# EAGLE board M868 (EAGLE 4.11), part 1 of 2
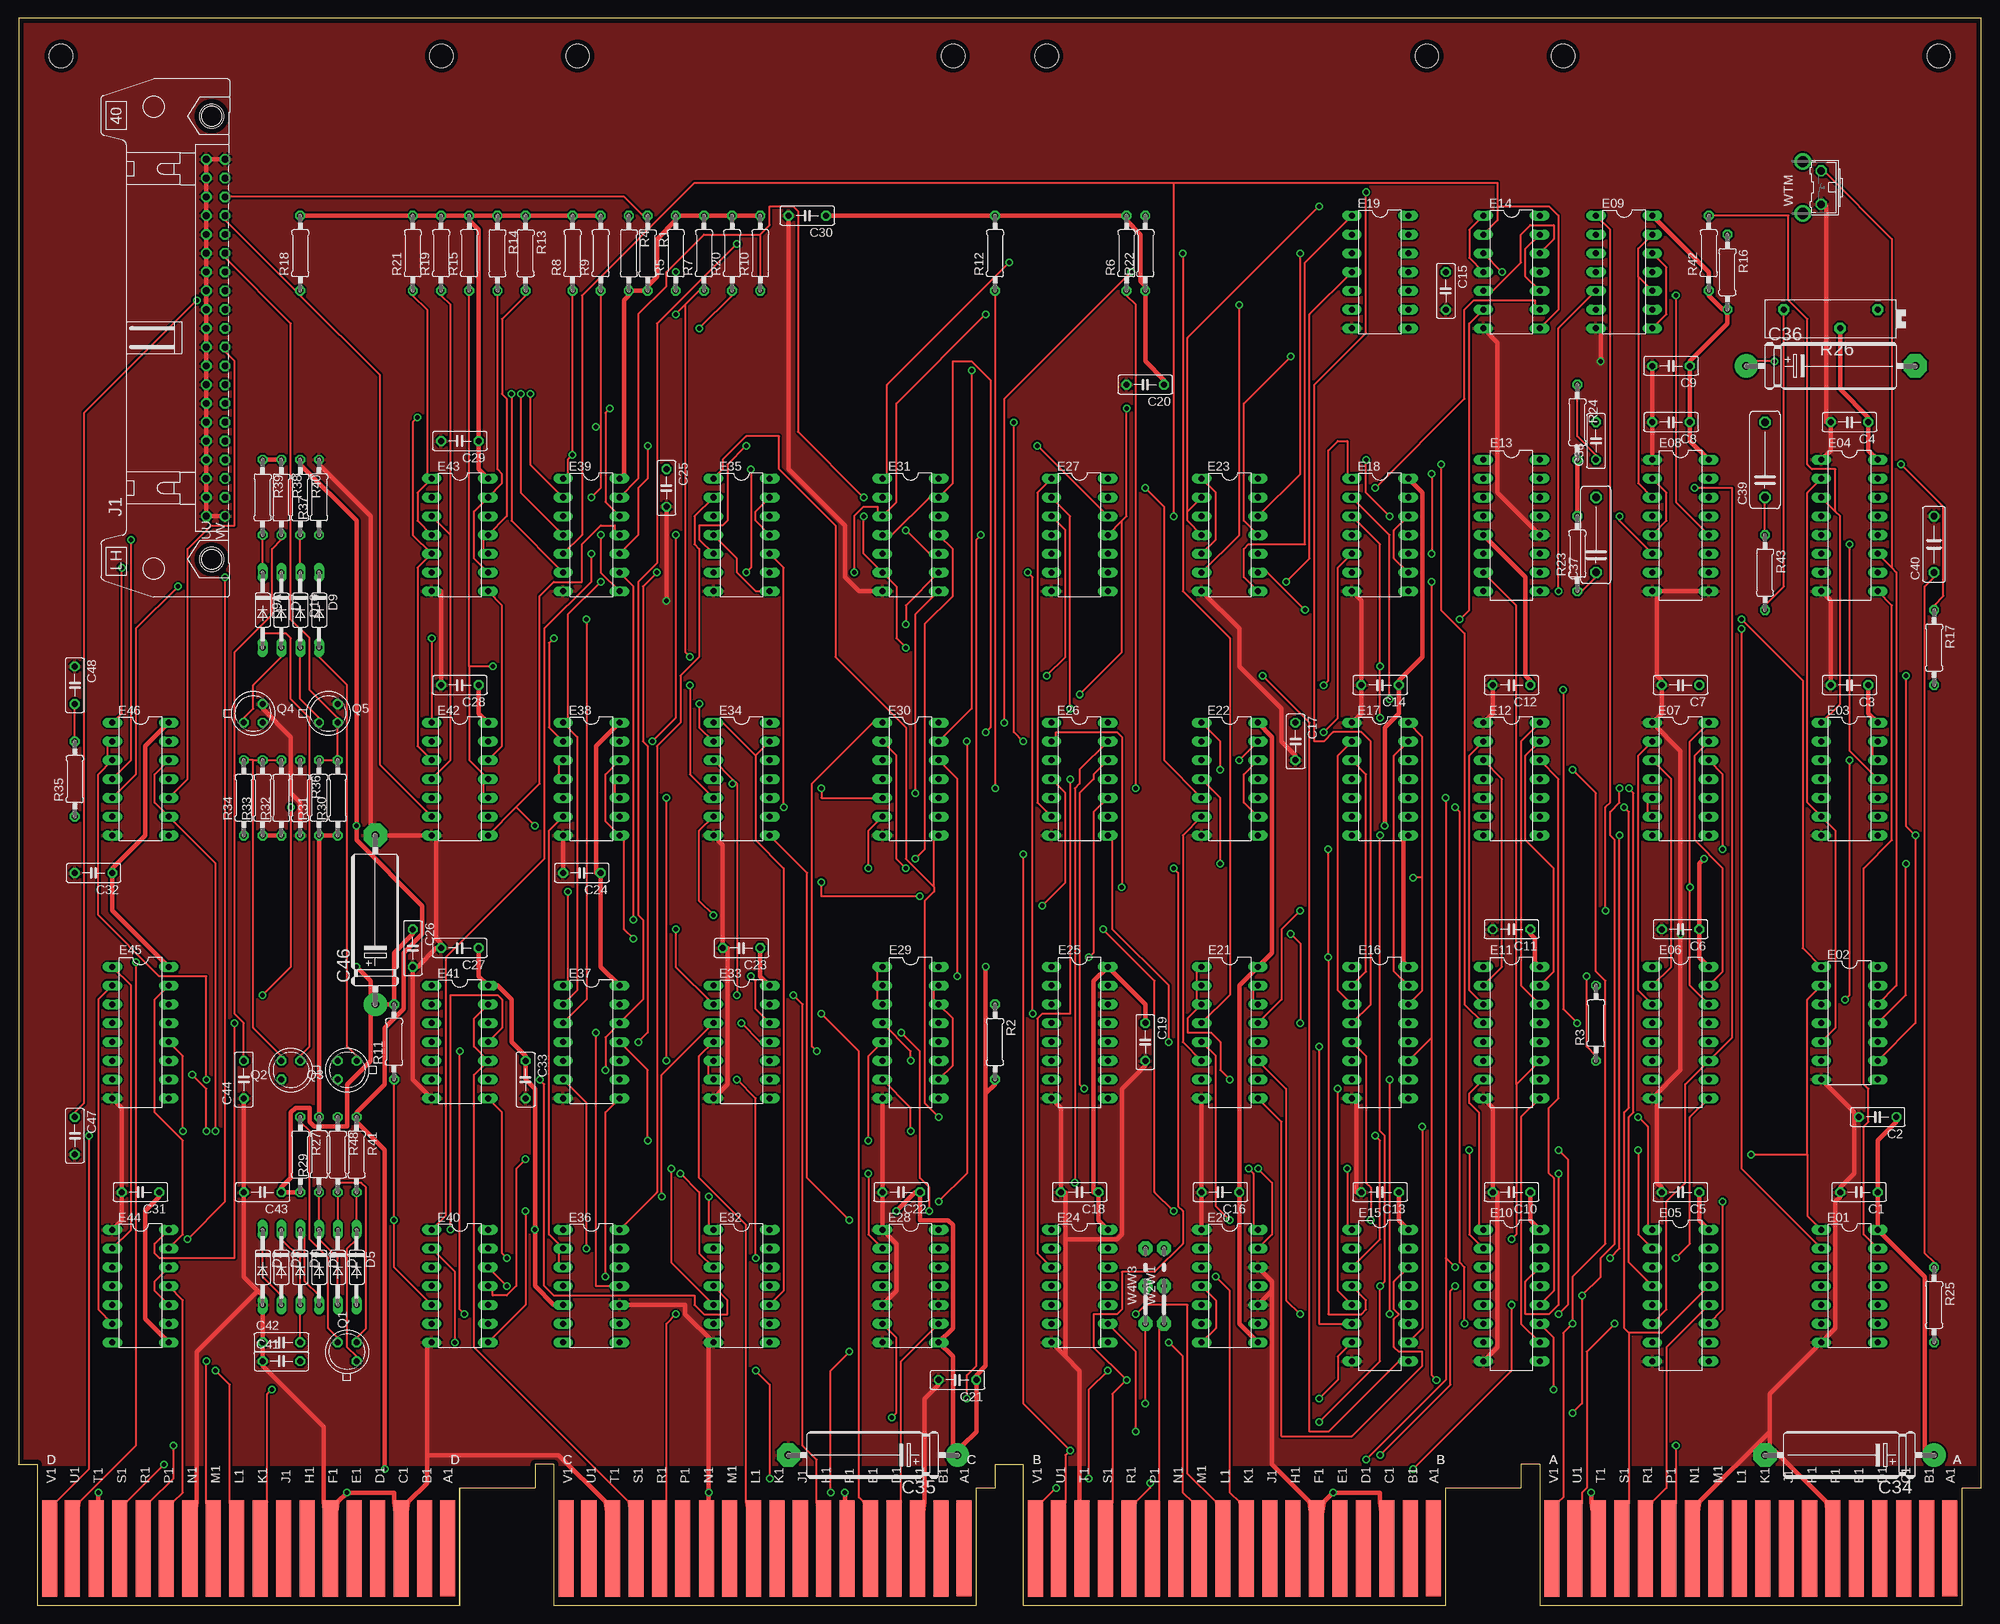
[diagram p3: board, top side]
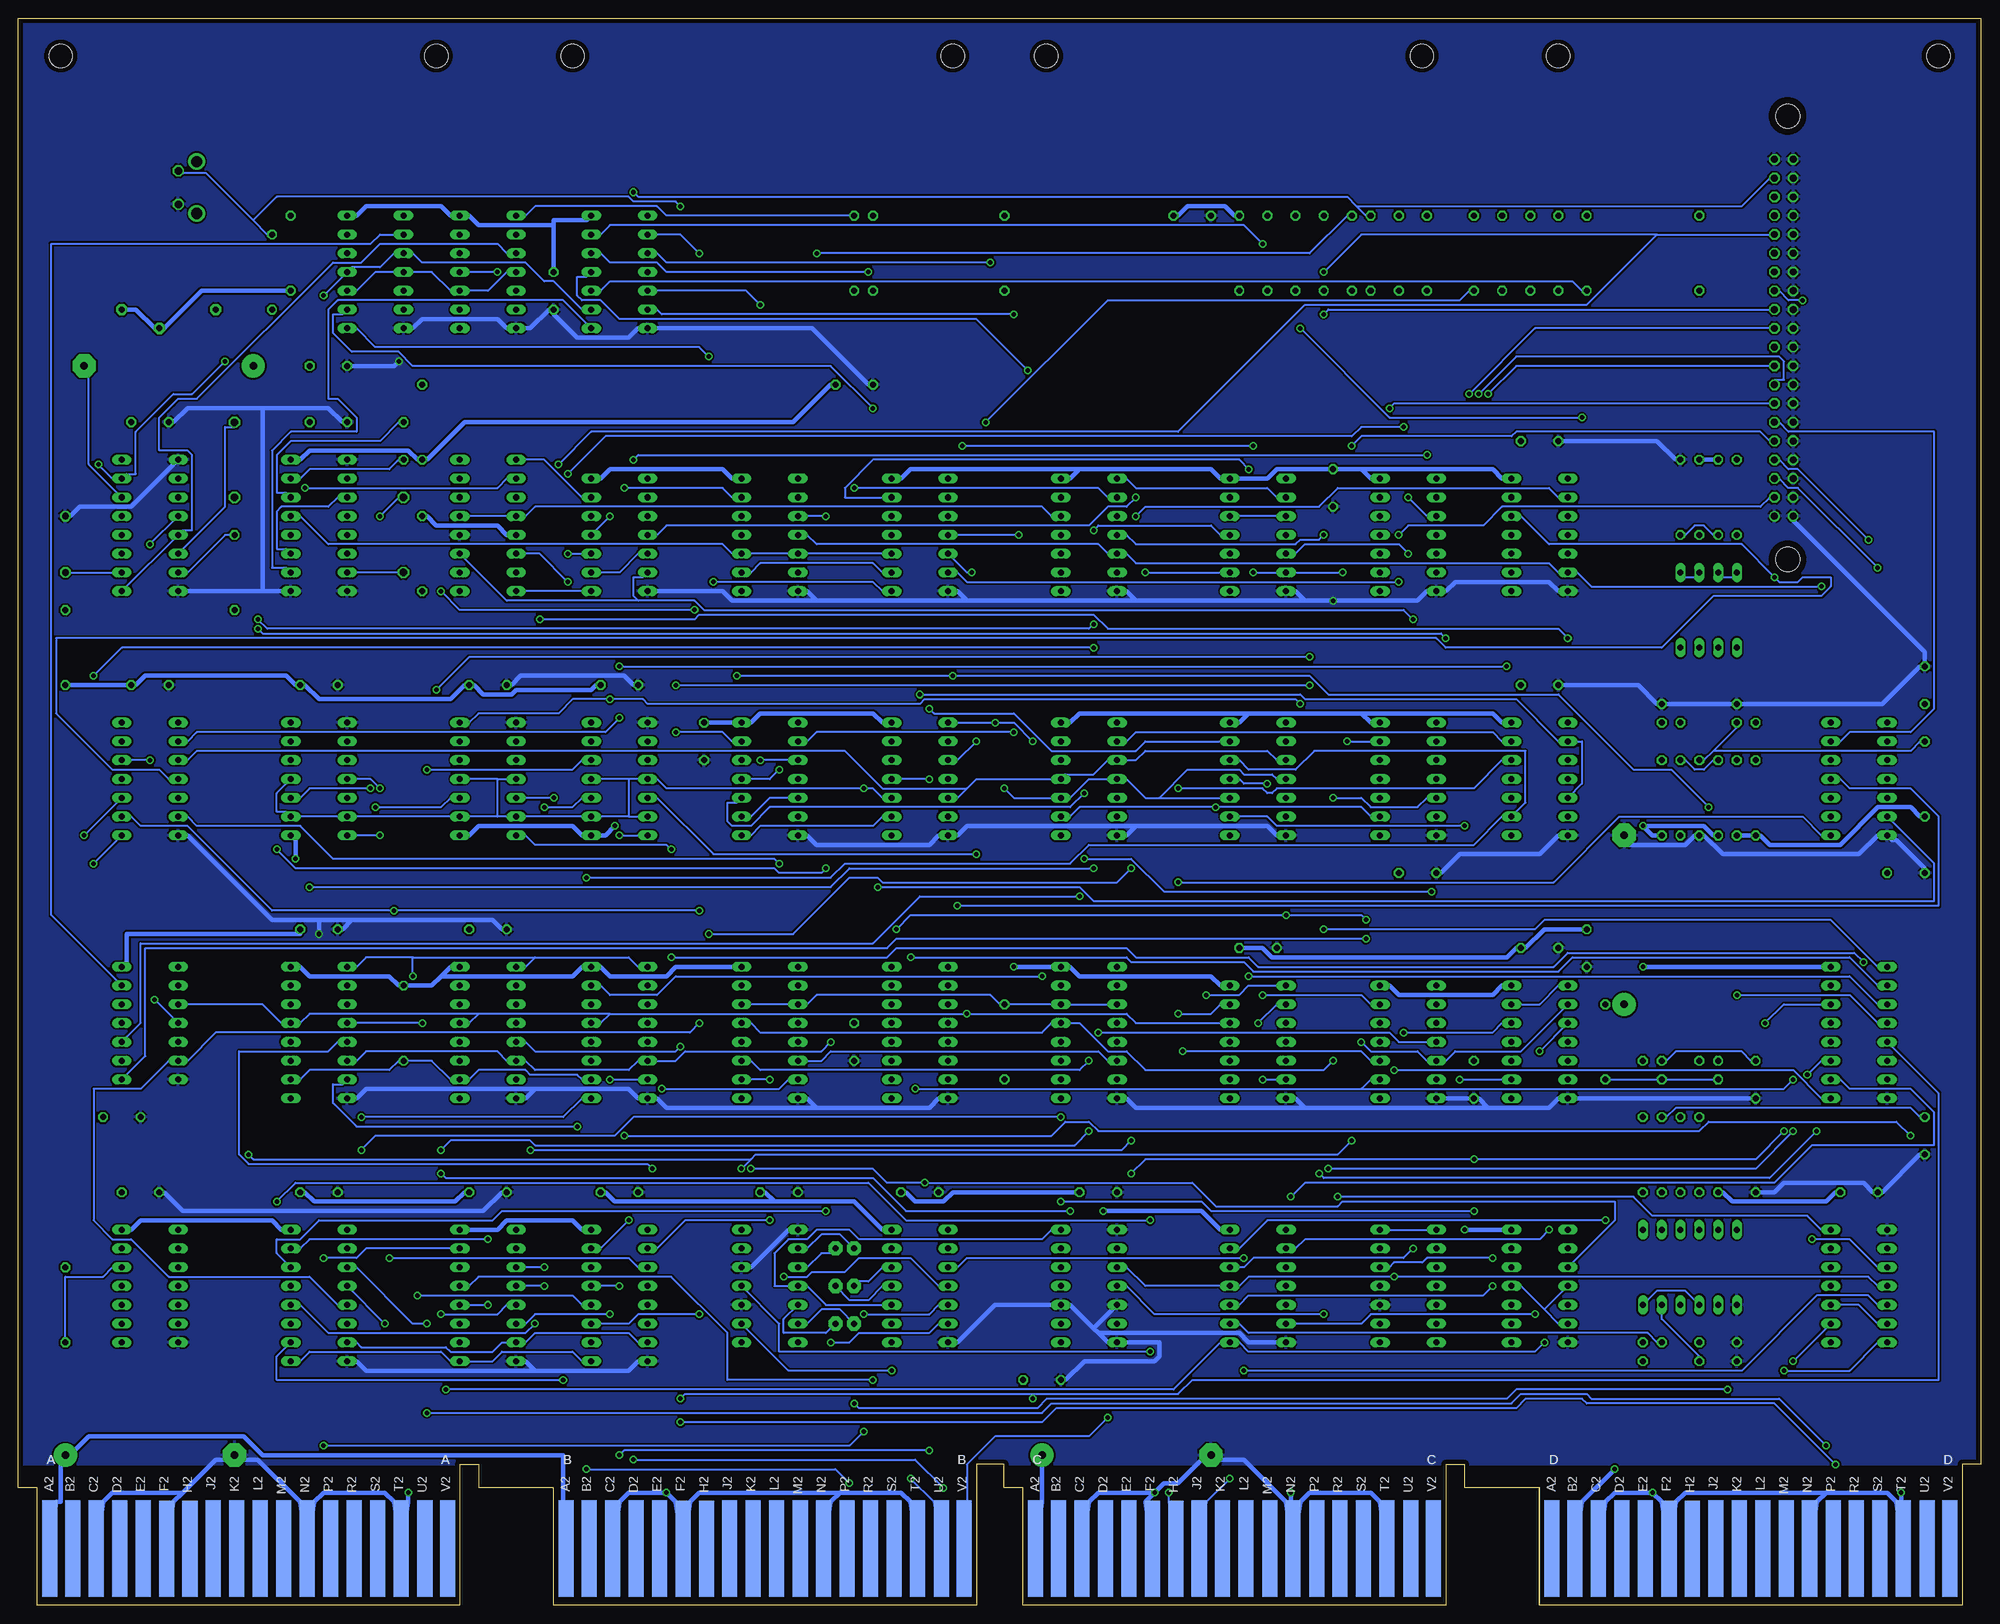
[diagram p4: board, bottom side, seen from below]

Size 265.43 x 214.63 mm. Coordinates in mm from the lower left corner, seen from the top.
Copper layers (1*16): Top 0.035mm / dielectric 1.5mm / Bottom 0.035mm
Design rules "10mils": minimum track width 10mil, minimum drill 24mil, track to track 10mil, track to pad 10mil, pad to pad 10mil, via to via 10mil, smd to smd 10mil, copper to edge 25mil, drill to drill 10mil, minimum pad ring 10mil, minimum via ring 8mil, stop-mask expansion 0mil, vias tented up to drill 0mil, thermal gap 10mil
Net classes: 1 supply: width 0.635 mm

## Footprints (pad centres in the part's own frame; a part is rotated, then mirrored left to right if it is on the bottom)
C050-025X075 = drill 0.813 octagon: 1 -2.54,0; 2 2.54,0
E22-6 = drill 1.016 pad 3.15 round: + -11.43,0 | drill 1.016 pad 3.15 octagon: - 11.43,0
C102-043X133 = drill 1.016 octagon: 1 -5.08,0; 2 5.08,0
C075-032X103 = drill 0.914 octagon: 1 -3.81,0; 2 3.81,0
DO35-10 = drill 0.813 long: A 5.08,0; C -5.08,0
DIL14 = drill 0.813 long: 1 -7.62,-3.81; 2 -5.08,-3.81; 3 -2.54,-3.81; 4 0,-3.81; 5 2.54,-3.81; 6 5.08,-3.81; 7 7.62,-3.81; 8 7.62,3.81; 9 5.08,3.81; 10 2.54,3.81; 11 0,3.81; 12 -2.54,3.81; 13 -5.08,3.81; 14 -7.62,3.81
DIL16 = drill 0.813 long: 1 -8.89,-3.81; 2 -6.35,-3.81; 3 -3.81,-3.81; 4 -1.27,-3.81; 5 1.27,-3.81; 6 3.81,-3.81; 7 6.35,-3.81; 8 8.89,-3.81; 9 8.89,3.81; 10 6.35,3.81; 11 3.81,3.81; 12 1.27,3.81; 13 -1.27,3.81; 14 -3.81,3.81; 15 -6.35,3.81; 16 -8.89,3.81
EDGE-CON8 = smd 2.032 x 13.017: AA1 261.223,7.709; AB1 258.118,7.684; AC1 254.956,7.684; AD1 251.765,7.684; AE1 248.59,7.693; AF1 245.389,7.668; AH1 242.24,7.668; AJ1 239.09,7.668; AK1 235.915,7.668; AL1 232.74,7.693; AM1 229.54,7.693; AN1 226.39,7.693; AP1 223.19,7.668; AR1 220.04,7.668; AS1 216.865,7.693; AT1 213.69,7.693; AU1 210.49,7.693; AV1 207.404,7.668; BA1 191.373,7.709; BB1 188.268,7.684; BC1 185.106,7.684; BD1 181.915,7.684; BE1 178.74,7.693; BF1 175.539,7.668; BH1 172.39,7.668; BJ1 169.24,7.668; BK1 166.065,7.668; BL1 162.89,7.693; BM1 159.69,7.693; BN1 156.54,7.693; BP1 153.34,7.668; BR1 150.19,7.668; BS1 147.015,7.693; BT1 143.84,7.693; BU1 140.64,7.693; BV1 137.554,7.668; CA1 127.873,7.709; CB1 124.768,7.684; CC1 121.606,7.684; CD1 118.415,7.684; CE1 115.24,7.693; CF1 112.039,7.668; CH1 108.89,7.668; CJ1 105.74,7.668; CK1 102.565,7.668; CL1 99.39,7.693; CM1 96.19,7.693; CN1 93.04,7.693; CP1 89.84,7.668; CR1 86.69,7.668; CS1 83.515,7.693; CT1 80.34,7.693; CU1 77.14,7.693; CV1 74.054,7.668; DA1 58.023,7.709; DB1 54.918,7.684; DC1 51.756,7.684; DD1 48.565,7.684; DE1 45.39,7.693; DF1 42.189,7.668; DH1 39.04,7.668; DJ1 35.89,7.668; DK1 32.715,7.668; DL1 29.54,7.693; DM1 26.34,7.693; DN1 23.19,7.693; DP1 19.99,7.668; DR1 16.84,7.668; DS1 13.665,7.693; DT1 10.49,7.693; DU1 7.29,7.693; DV1 4.204,7.668 | smd 2.032 x 13.017 bottom: AA2 261.223,7.69; AB2 258.102,7.668; AC2 254.94,7.668; AD2 251.765,7.693; AE2 248.59,7.693; AF2 245.389,7.642; AH2 242.24,7.642; AJ2 239.09,7.668; AK2 235.915,7.668; AL2 232.74,7.693; AM2 229.54,7.693; AN2 226.39,7.693; AP2 223.19,7.668; AR2 220.04,7.668; AS2 216.865,7.693; AT2 213.69,7.693; AU2 210.464,7.693; AV2 207.404,7.668; BA2 191.373,7.69; BB2 188.252,7.668; BC2 185.09,7.668; BD2 181.915,7.693; BE2 178.74,7.693; BF2 175.539,7.642; BH2 172.39,7.642; BJ2 169.24,7.668; BK2 166.065,7.668; BL2 162.89,7.693; BM2 159.69,7.693; BN2 156.54,7.693; BP2 153.34,7.668; BR2 150.19,7.668; BS2 147.015,7.693; BT2 143.84,7.693; BU2 140.614,7.693; BV2 137.554,7.668; CA2 127.873,7.69; CB2 124.752,7.668; CC2 121.59,7.668; CD2 118.415,7.693; CE2 115.24,7.693; CF2 112.039,7.642; CH2 108.89,7.642; CJ2 105.74,7.668; CK2 102.565,7.668; CL2 99.39,7.693; CM2 96.19,7.693; CN2 93.04,7.693; CP2 89.84,7.668; CR2 86.69,7.668; CS2 83.515,7.693; CT2 80.34,7.693; CU2 77.114,7.693; CV2 74.054,7.668; DA2 58.023,7.69; DB2 54.902,7.668; DC2 51.74,7.668; DD2 48.565,7.693; DE2 45.39,7.693; DF2 42.189,7.642; DH2 39.04,7.642; DJ2 35.89,7.668; DK2 32.715,7.668; DL2 29.54,7.693; DM2 26.34,7.693; DN2 23.19,7.693; DP2 19.99,7.668; DR2 16.84,7.668; DS2 13.665,7.693; DT2 10.49,7.693; DU2 7.264,7.693; DV2 4.204,7.668
DEC40PINH = drill 0.914 octagon: A 24.13,1.27; AA -3.81,1.27; B 24.13,-1.27; BB -3.81,-1.27; C 21.59,1.27; CC -6.35,1.27; D 21.59,-1.27; DD -6.35,-1.27; E 19.05,1.27; EE -8.89,1.27; F 19.05,-1.27; FF -8.89,-1.27; H 16.51,1.27; HH -11.43,1.27; J 16.51,-1.27; JJ -11.43,-1.27; K 13.97,1.27; KK -13.97,1.27; L 13.97,-1.27; LL -13.97,-1.27; M 11.43,1.27; MM -16.51,1.27; N 11.43,-1.27; NN -16.51,-1.27; P 8.89,1.27; PP -19.05,1.27; R 8.89,-1.27; RR -19.05,-1.27; S 6.35,1.27; SS -21.59,1.27; T 6.35,-1.27; TT -21.59,-1.27; U 3.81,1.27; UU -24.13,1.27; V 3.81,-1.27; W 1.27,1.27; X 1.27,-1.27; Y -1.27,1.27; Z -1.27,-1.27 | drill 0.914 round: VV -24.13,-1.27 | hole 3.302: -29.972,0.533; 29.972,0.533
TO18 = drill 0.813 octagon: 1 -1.27,-1.27; 2 1.27,-1.27; 3 1.27,1.27
0207/10 = drill 0.813 octagon: 1 -5.08,0; 2 5.08,0
PT-SPIN = drill 0.813 pad 1.524 octagon: 1 -6.35,-1.27; 2 6.35,-1.27; 3 -1.27,1.27
OMNIBUS = hole 3.175: 208.915,209.55; 259.715,209.55; 190.5,209.55; 139.065,209.55; 75.616,209.55; 126.416,209.55; 57.201,209.55; 5.766,209.55
05C = drill 0.813 pad 1.905 octagon: 1 -2.54,0; 2 2.54,0; 3 7.62,0
B3F-31XX = drill 1.016 octagon: 1 -2.261,-1.245; 2 2.261,-1.245 | drill 1.499 pad 2.159 round: 3 -3.505,1.245; 4 3.505,1.245

## Placement (x,y rotation side)
C1  .01  [C050-025X075]  248.92,55.88 180 top
C2  .01  [C050-025X075]  251.46,66.04 180 top
C3  .01  [C050-025X075]  247.65,124.46 180 top
C4  .01  [C050-025X075]  247.65,160.02 180 top
C5  .01  [C050-025X075]  224.79,55.88 180 top
C6  .01  [C050-025X075]  224.79,91.44 180 top
C7  .01  [C050-025X075]  224.79,124.46 180 top
C8  .01  [C050-025X075]  223.52,160.02 180 top
C9  .01  [C050-025X075]  223.52,167.64 180 top
C10  .01  [C050-025X075]  201.93,55.88 180 top
C11  .01  [C050-025X075]  201.93,91.44 180 top
C12  .01  [C050-025X075]  201.93,124.46 180 top
C13  .01  [C050-025X075]  184.15,55.88 180 top
C14  .01  [C050-025X075]  184.15,124.46 180 top
C15  .01  [C050-025X075]  193.04,177.8 270 top
C16  .01  [C050-025X075]  162.56,55.88 180 top
C17  .01  [C050-025X075]  172.72,116.84 270 top
C18  .01  [C050-025X075]  143.51,55.88 180 top
C19  .01  [C050-025X075]  152.4,76.2 270 top
C20  .01  [C050-025X075]  152.4,165.1 180 top
C21  .01  [C050-025X075]  127,30.48 180 top
C22  .01  [C050-025X075]  119.38,55.88 180 top
C23  .01  [C050-025X075]  97.79,88.9 180 top
C24  .01  [C050-025X075]  76.2,99.06 180 top
C25  .01  [C050-025X075]  87.63,151.13 270 top
C26  .01  [C050-025X075]  53.34,88.9 270 top
C27  .01  [C050-025X075]  59.69,88.9 180 top
C28  .01  [C050-025X075]  59.69,124.46 180 top
C29  .01  [C050-025X075]  59.69,157.48 180 top
C30  .01  [C050-025X075]  106.68,187.96 180 top
C31  .01  [C050-025X075]  16.51,55.88 180 top
C32  .01  [C050-025X075]  10.16,99.06 180 top
C33  .01  [C050-025X075]  68.58,71.12 270 top
C34  6.8  [E22-6]  247.65,20.32 180 top
C35  6.8  [E22-6]  115.57,20.32 180 top
C36  6.8  [E22-6]  245.11,167.64 0 top
C37  2700pf  [C102-043X133]  213.36,144.78 90 top
C38  27pf  [C050-025X075]  213.36,157.48 90 top
C39  2700pf  [C102-043X133]  236.22,154.94 90 top
C40  560pf  [C075-032X103]  259.08,143.51 90 top
C41  .01  [C050-025X075]  35.56,33.02 0 top
C42  .01  [C050-025X075]  35.56,35.56 0 top
C43  .01  [C050-025X075]  33.02,55.88 180 top
C44  .01  [C050-025X075]  30.48,71.12 90 top
C46  6.8  [E22-6]  48.26,92.71 90 top
C47  .01  [C050-025X075]  7.62,63.5 270 top
C48  .01  [C050-025X075]  7.62,124.46 270 top
D1  D664  [DO35-10]  43.18,45.72 270 top
D2  D662  [DO35-10]  33.02,45.72 270 top
D3  D662  [DO35-10]  35.56,45.72 270 top
D4  D662  [DO35-10]  38.1,45.72 270 top
D5  D664  [DO35-10]  45.72,45.72 270 top
D6  D662  [DO35-10]  40.64,45.72 270 top
D7  D664  [DO35-10]  35.56,134.62 270 top
D9  D664  [DO35-10]  40.64,134.62 270 top
D9A  D664  [DO35-10]  33.02,134.62 270 top
D10  D664  [DO35-10]  38.1,134.62 270 top
E01  74H04N  [DIL14]  247.65,43.18 270 top
E02  7402N  [DIL14]  247.65,78.74 270 top
E03  7474N  [DIL14]  247.65,111.76 270 top
E04  74123N  [DIL16]  247.65,146.05 270 top
E05  DEC8235  [DIL16]  224.79,41.91 270 top
E06  DEC8271  [DIL16]  224.79,77.47 270 top
E07  SP380N  [DIL14]  224.79,111.76 270 top
E08  74123N  [DIL16]  224.79,146.05 270 top
E09  7474N  [DIL14]  217.17,180.34 270 top
E10  DEC8235  [DIL16]  201.93,41.91 270 top
E11  DEC8271  [DIL16]  201.93,77.47 270 top
E12  SP380N  [DIL14]  201.93,111.76 270 top
E13  7475N  [DIL16]  201.93,146.05 270 top
E14  7474N  [DIL14]  201.93,180.34 270 top
E15  DEC8235  [DIL16]  184.15,41.91 270 top
E16  DEC8271  [DIL16]  184.15,77.47 270 top
E17  SP380N  [DIL14]  184.15,111.76 270 top
E18  DEC8242  [DIL14]  184.15,144.78 270 top
E19  7400N  [DIL14]  184.15,180.34 270 top
E20  SP380N  [DIL14]  163.83,43.18 270 top
E21  DEC8271  [DIL16]  163.83,77.47 270 top
E22  7400N  [DIL14]  163.83,111.76 270 top
E23  7410N  [DIL14]  163.83,144.78 270 top
E24  SP314N  [DIL14]  143.51,43.18 270 top
E25  [DIL16]  143.51,77.47 270 top
E26  7404N  [DIL14]  143.51,111.76 270 top
E27  7410N  [DIL14]  143.51,144.78 270 top
E28  SP384N  [DIL14]  120.65,43.18 270 top
E29  DEC8271  [DIL16]  120.65,77.47 270 top
E30  7474N  [DIL14]  120.65,111.76 270 top
E31  7404N  [DIL14]  120.65,144.78 270 top
E32  7404N  [DIL14]  97.79,43.18 270 top
E33  N8881N  [DIL14]  97.79,76.2 270 top
E34  7474N  [DIL14]  97.79,111.76 270 top
E35  7410N  [DIL14]  97.79,144.78 270 top
E36  74LS93N  [DIL14]  77.47,43.18 270 top
E37  7402N  [DIL14]  77.47,76.2 270 top
E38  7400N  [DIL14]  77.47,111.76 270 top
E39  7417N  [DIL14]  77.47,144.78 270 top
E40  7430N  [DIL14]  59.69,43.18 270 top
E41  N8881N  [DIL14]  59.69,76.2 270 top
E42  DEC8242  [DIL14]  59.69,111.76 270 top
E43  7401N  [DIL14]  59.69,144.78 270 top
E44  SP380N  [DIL14]  16.51,43.18 270 top
E45  DEC8251  [DIL16]  16.51,77.47 270 top
E46  7401N  [DIL14]  16.51,111.76 270 top
EDGE$  [EDGE-CON8]  0,0 0 top
J1  [DEC40PINH]  26.67,171.45 90 top
Q1  MPS6534  [TO18]  44.45,34.29 90 top
Q2  MPS6534  [TO18]  36.83,72.39 180 top
Q3  MPS6534  [TO18]  44.45,72.39 180 top
Q4  MPS6534  [TO18]  31.75,120.65 0 top
Q5  MPS6534  [TO18]  41.91,120.65 0 top
R1  270  [0207/10]  85.09,182.88 270 top
R2  1K  [0207/10]  132.08,76.2 270 top
R3  1K  [0207/10]  213.36,78.74 90 top
R4  270  [0207/10]  82.55,182.88 270 top
R5  270  [0207/10]  88.9,182.88 90 top
R6  560  [0207/10]  149.86,182.88 90 top
R7  270  [0207/10]  92.71,182.88 90 top
R8  470  [0207/10]  74.93,182.88 90 top
R9  470  [0207/10]  78.74,182.88 90 top
R10  470  [0207/10]  100.33,182.88 90 top
R11  6.8K  [0207/10]  50.8,76.2 90 top
R12  1K  [0207/10]  132.08,182.88 90 top
R13  470  [0207/10]  68.58,182.88 270 top
R14  470  [0207/10]  64.77,182.88 270 top
R15  470  [0207/10]  60.96,182.88 90 top
R16  1.5K  [0207/10]  231.14,180.34 270 top
R17  51K  [0207/10]  259.08,129.54 270 top
R18  270  [0207/10]  38.1,182.88 90 top
R19  470  [0207/10]  57.15,182.88 90 top
R20  470  [0207/10]  96.52,182.88 90 top
R21  470  [0207/10]  53.34,182.88 90 top
R22  1K  [0207/10]  152.4,182.88 90 top
R23  10K  [0207/10]  210.82,142.24 90 top
R24  4.7K  [0207/10]  210.82,160.02 270 top
R25  220  [0207/10]  259.08,40.64 270 top
R26  10K  [PT-SPIN]  245.11,173.99 180 top
R27  1.5K  [0207/10]  38.1,60.96 270 top
R29  1.5K  [0207/10]  40.64,60.96 90 top
R30  1K  [0207/10]  43.18,109.22 90 top
R31  1K  [0207/10]  40.64,109.22 90 top
R32  1K  [0207/10]  35.56,109.22 90 top
R33  1K  [0207/10]  33.02,109.22 90 top
R34  1K  [0207/10]  30.48,109.22 90 top
R35  1.21K 1%  [0207/10]  7.62,111.76 90 top
R36  562 1%  [0207/10]  38.1,109.22 270 top
R37  1.5K  [0207/10]  40.64,149.86 90 top
R38  1K  [0207/10]  35.56,149.86 270 top
R39  1.5K  [0207/10]  33.02,149.86 270 top
R40  1K  [0207/10]  38.1,149.86 270 top
R41  3K  [0207/10]  45.72,60.96 270 top
R42  1K  [0207/10]  228.6,182.88 90 top
R43  4.7K  [0207/10]  236.22,139.7 270 top
R48  470  [0207/10]  43.18,60.96 270 top
U$1  OUTLINE-OMNIBUS  [OMNIBUS]  0,0 0 top
W2W1  [05C]  154.94,40.64 90 top
W4W3  [05C]  152.4,40.64 90 top
WTM  [B3F-31XX]  242.57,191.77 90 top

## Tracks (layer width: path | path; a pad name or v marks a point on that pad's centre or on a via)
-1.5V
  Top 0.254: C42.2 D4.A 38.1,46.99 35.56,49.53 D3.C
  Bottom 0.254: D5.A 43.81,42.55 40.01,42.55 D4.A
-3V
  Top 0.254: R29.1 D6.C 40.64,49.53 43.18,46.99 D1.A
  Bottom 0.254: C41.2 38.1,33.66 43.18,38.74 D1.A
-4.7V
  Top 0.254: R35.2 C48.2
  Bottom 0.254: 36.2,115.57 33.02,118.75 Q4.2 | 36.2,115.57 37.47,114.3 R36.1 | 36.2,115.57 9.53,115.57 8.26,116.84 R35.2
-9V
  Top 0.254: R38.2 35.56,144.15 34.29,142.88 34.29,133.99 29.21,128.91 29.21,80.01 30.48,78.74 C44.2
  Bottom 0.254: R38.2 36.2,144.78 37.47,146.05 38.73,146.05 40.01,144.78 R37.1 | C44.2 31.11,73.66 32.38,74.93 41.27,74.93 42.55,73.66 Q3.2
-15V  (via drill 0.61)
  Top 0.635: v49.53,18.42 49.53,61.6 45.72,65.41 R41.1 45.72,66.68 49.53,70.49 49.53,78.11 52.07,80.65 52.07,88.27 54.61,90.81 54.61,94.62 45.72,103.51 v45.72,105.41 45.72,146.69 38.1,154.31 R40.1 | R32.1 R33.1 | R38.1 R39.1 | R29.2 R31.1 R30.1
  Bottom 0.635: v49.53,18.42 53.98,13.97 EDGE$.DB2 | R33.1 R34.1 29.84,104.14 28.57,102.87 19.05,102.87 13.97,107.95 9.53,107.95 8.26,106.68 R35.1 | R40.1 R38.1 | R30.1 44.45,104.14 v45.72,105.41 37.47,105.41 36.2,104.14 R32.1
C0  (via drill 0.61)
  Top 0.254: v108.58,80.01 113.67,74.93 113.67,14.61 114.3,13.97 EDGE$.CE1
  Bottom 0.254: v108.58,80.01 104.14,80.01 102.87,81.28 E33.13
C1  (via drill 0.61)
  Top 0.254: v104.78,82.55 106.05,81.28 106.05,21.59 107.95,19.69 107.95,13.97 EDGE$.CH1
  Bottom 0.254: v104.78,82.55 100.33,82.55 99.06,83.82 E33.1
CC_67X  (via drill 0.61)
  Top 0.254: E33.6 93.34,71.76 93.34,73.03 E33.5 | v142.24,111.76 142.24,80.01 138.43,80.01 137.79,79.38 137.79,47.63 E24.3 | v97.16,71.12 99.69,68.58 v99.69,46.99
  Bottom 0.254: v142.24,111.76 E26.11 | v99.69,46.99 137.16,46.99 138.43,45.72 E24.3 | v97.16,71.12 E33.6
CC_67X\  (via drill 0.61)
  Top 0.254: E45.2 10.79,81.92 10.79,40.01 E44.6 | E44.12 18.41,43.82 18.41,42.55 E44.10 | E07.6 220.34,107.32 220.34,108.59 E07.5 | v151.13,110.49 151.13,175.9 149.86,177.17 R6.1 | v144.78,87.63 145.41,88.27 145.41,107.32 E26.10
  Bottom 0.254: E44.6 13.97,38.1 16.51,40.64 E44.10 | E07.11 230.5,109.86 230.5,107.32 229.24,107.32 E07.9 E07.6 E12.9 200.66,106.68 | 200.66,106.68 E12.6 E17.9 182.88,106.68 | 200.66,111.76 E12.4 | 200.66,111.76 E12.11 | 200.66,106.68 200.66,111.76 | 182.88,106.68 E17.6 | E26.10 148.59,109.22 149.86,110.49 v151.13,110.49 177.8,110.49 179.07,111.76 E17.4 182.88,111.76 | 182.88,111.76 E17.11 | 182.88,111.76 182.88,106.68 | v144.78,87.63 115.57,87.63 114.94,87 99.69,87 98.42,85.73 57.15,85.73 55.24,87.63 17.78,87.63 13.97,83.82 E45.2
CC_BTP3  (via drill 0.61)
  Top 0.254: v233.04,132.08 233.04,59.06 E01.2 | v72.39,130.81 71.75,130.18 71.75,118.75 E38.2
  Bottom 0.254: v233.04,132.08 232.41,131.45 73.03,131.45 v72.39,130.81
CC_CLK_TE\
  Top 0.254: E26.6 137.79,108.59 137.79,150.5 E27.1
CC_DTP
  Top 0.254: E23.1 161.93,150.5 161.93,144.15 E23.5
  Bottom 0.254: E27.10 E23.5 E23.10 168.91,142.24 170.18,143.51 223.52,143.51 227.33,147.32 E08.13
CC_DTP0  (via drill 0.61)
  Top 0.254: v113.03,139.7 113.03,147.32 114.3,148.59 116.2,148.59 116.2,147.96 E31.3 118.75,149.23 118.75,162.56 v130.81,174.63
  Bottom 0.254: v113.03,139.7 E35.9 | v130.81,174.63 178.44,174.63 179.07,175.26 E19.6
CC_DTP0\  (via drill 0.61)
  Top 0.254: v85.72,116.84 88.9,120.02 v88.9,144.78 | E31.4 118.11,144.78 123.19,149.86 E31.13 126.36,151.77 126.36,168.28 128.91,168.28 131.44,165.74 131.44,118.75 v130.81,118.11
  Bottom 0.254: v88.9,144.78 89.53,144.15 92.08,144.15 92.71,143.51 114.3,143.51 115.57,144.78 E31.4 | v85.72,116.84 E38.13 | v130.81,118.11 157.48,118.11 158.75,116.84 E22.2
CC_DTP1  (via drill 0.61)
  Top 0.254: v133.99,181.61 117.47,165.1 117.47,153.04 E31.1 | E36.14 86.36,55.88 86.36,116.21 89.53,119.38 89.53,125.73 92.08,128.27 92.08,142.88 91.44,143.51 91.44,147.32 E35.2
  Bottom 0.254: E36.14 E36.1 | E35.2 95.25,149.86 96.52,151.13 114.3,151.13 115.57,152.4 E31.1 | v133.99,181.61 177.8,181.61 179.07,182.88 E19.3
CC_DTP1\  (via drill 0.61)
  Top 0.254: v152.4,151.13 154.94,148.59 154.94,114.3 E22.5 | E22.12 165.74,112.4 165.74,108.59 E22.9
  Bottom 0.254: v152.4,151.13 119.38,151.13 118.11,149.86 E31.2 | E22.9 166.37,106.68 163.83,109.22 E22.5
CC_F/R  (via drill 0.61)
  Top 0.254: v90.81,124.46 90.81,112.4 E34.5 | v176.53,124.46 177.16,125.1 177.16,156.21 178.44,157.48 179.71,157.48 179.71,153.04 E18.1
  Bottom 0.254: v176.53,124.46 v90.81,124.46
CC_F/R\  (via drill 0.61)
  Top 0.254: v156.21,53.34 153.67,55.88 153.67,84.46 v146.69,91.44 | v93.98,93.35 92.08,95.25 92.08,104.78 E34.6 | v83.19,92.71 83.19,137.8 E39.9
  Bottom 0.254: v156.21,53.34 200.03,53.34 201.29,52.07 224.79,52.07 227.33,49.53 230.5,49.53 230.5,47.63 E05.14 | v146.69,91.44 144.78,93.35 v93.98,93.35 83.82,93.35 v83.19,92.71
CC_INIT  (via drill 0.61)
  Top 0.254: v79.38,44.45 79.38,66.68 E37.8
  Bottom 0.254: E44.4 13.97,43.18 15.24,44.45 v79.38,44.45 99.06,44.45 100.33,43.18 E32.11 113.03,43.18 115.57,45.72 E28.3
CC_INIT\  (via drill 0.61)
  Top 0.254: 99.69,114.94 99.69,103.51 103.5,99.7 103.5,42.55 E32.10 | E34.13 99.69,114.94 | v66.04,43.18 E40.12 | 99.69,114.94 95.25,119.38 E34.1 | v142.24,121.29 142.24,147.32 E27.2
  Bottom 0.254: v66.04,43.18 67.31,41.91 99.06,41.91 100.33,40.64 E32.10 | v142.24,121.29 141.6,120.65 130.81,120.65 125.73,115.57 114.3,115.57 113.03,116.84 E34.13
CC_PWR_OK  (via drill 0.61)
  Top 0.254: E46.12 18.41,112.4 18.41,108.59 E46.9 26.67,100.33 v26.67,64.14 | v114.94,58.42 114.94,50.17 E28.2 | v68.58,60.33 67.31,59.06 67.31,43.18 66.04,41.91 64.14,41.91 64.14,42.55 E40.11
  Bottom 0.254: 59.05,40.01 62.23,43.18 E40.11 | 59.05,40.01 57.15,38.1 E40.6 | 59.05,40.01 E40.4 | v114.94,58.42 113.03,60.33 v68.58,60.33 30.48,60.33 v26.67,64.14
CC_R/W  (via drill 0.61)
  Top 0.254: v103.5,107.95 103.5,140.34 E35.10
  Bottom 0.254: E38.9 82.55,106.68 83.82,107.95 v103.5,107.95 121.92,107.95 123.19,106.68 E30.9
CC_R/W\  (via drill 0.61)
  Top 0.254: v219.07,61.6 219.07,50.17 E05.2 | v124.46,66.04 122.56,67.95 122.56,95.25 123.83,96.52 123.83,97.16 | 123.83,97.16 123.83,103.51 E30.8 | 123.83,97.16 120.02,100.97 120.02,118.75 110.49,128.27 110.49,146.05 102.87,153.67 102.87,158.12 98.42,158.12 95.25,154.94 95.25,153.67 E35.1
  Bottom 0.254: v219.07,61.6 217.17,63.5 184.78,63.5 182.25,66.04 v124.46,66.04
CC_RUN  (via drill 0.61)
  Top 0.254: E46.2 12.06,116.21 12.06,114.94 E46.3 10.79,112.4 10.79,93.35 19.05,85.09 25.4,85.09 v25.4,71.12 | v144.15,69.85 143.51,70.49 143.51,109.86 145.41,111.76 145.41,112.4 E26.12
  Bottom 0.254: 83.82,69.85 82.55,71.12 E37.9 | v144.15,69.85 83.82,69.85 | v25.4,71.12 26.67,69.85 83.82,69.85
CC_RUN\  (via drill 0.61)
  Top 0.254: v166.37,59.06 167,58.42 167,51.44 E20.14 | v142.88,57.15 142.88,110.49 143.51,111.13 143.51,113.03 E26.13
  Bottom 0.254: v166.37,59.06 149.86,59.06 147.96,57.15 v142.88,57.15 106.68,57.15 103.5,53.98 87,53.98 86.36,54.61 49.53,54.61 49.53,52.07 E40.3
CC_S/G  (via drill 0.61)
  Top 0.254: E42.12 65.41,116.21 65.41,135.26 E43.8 | v108.58,110.49 108.58,109.22 E30.5
  Bottom 0.254: v108.58,110.49 97.16,110.49 96.52,109.86 95.89,109.86 95.25,110.49 68.58,110.49 64.77,114.3 E42.12
CC_S/G\  (via drill 0.61)
  Top 0.254: v114.94,99.7 114.94,104.78 E30.6 | v172.09,90.81 173.35,89.54 v173.35,78.74
  Bottom 0.254: E05.5 222.25,40.64 226.06,44.45 245.11,44.45 250.19,49.53 252.73,49.53 255.27,52.07 255.27,69.85 248.92,69.85 245.11,73.66 E02.6 242.57,73.66 238.76,77.47 174.62,77.47 v173.35,78.74 | v114.94,99.7 116.84,97.79 148.59,97.79 149.22,98.43 153.03,98.43 160.66,90.81 v172.09,90.81
CC_SDLC\  (via drill 0.61)
  Top 0.254: v79.38,72.39 79.38,76.84 E37.12 84.45,81.92 84.45,92.71 83.82,93.35 83.82,138.43 86.36,140.97 86.36,173.36 v97.16,184.15
  Bottom 0.254: v79.38,72.39 25.4,72.39 21.59,68.58 E45.9 | v97.16,184.15 99.69,186.69 185.42,186.69 186.69,185.42 E19.13
CC_SDLD\  (via drill 0.61)
  Top 0.254: v99.06,85.09 99.69,84.46 99.69,80.65 E33.12 | v136.53,139.7 137.16,139.07 v137.16,80.01
  Bottom 0.254: E02.3 232.41,81.28 229.87,78.74 E06.13 227.33,78.74 226.06,80.01 203.2,80.01 | 185.42,80.01 v137.16,80.01 115.57,80.01 114.3,78.74 E33.12 | 185.42,80.01 186.69,78.74 E16.13 | 203.2,80.01 204.47,78.74 E11.13 | 185.42,80.01 203.2,80.01 | v99.06,85.09 17.78,85.09 13.97,81.28 E45.3 | v136.53,139.7 137.16,139.7 E27.5
CC_SDRC\  (via drill 0.61)
  Top 0.254: v33.02,82.55 36.83,86.36 v36.83,107.95 | v139.06,125.73 141.6,128.27 141.6,145.42 E27.3 | v168.28,125.73 174.62,119.38 174.62,23.5 177.16,23.5 186.69,33.02 E15.9
  Bottom 0.254: E15.9 189.23,33.02 190.5,34.29 200.03,34.29 201.29,33.02 E10.9 207.01,33.02 208.28,34.29 226.06,34.29 227.33,33.02 E05.9 | v33.02,82.55 17.78,82.55 13.97,78.74 E45.4 | v36.83,107.95 41.91,113.03 46.99,113.03 57.15,123.19 88.27,123.19 90.81,125.73 v139.06,125.73 v168.28,125.73
CC_SDRD\  (via drill 0.61)
  Top 0.254: v175.9,27.94 178.44,30.48 178.44,33.66 E15.7 | v130.18,144.78 129.54,144.15 129.54,32.39 128.27,31.12 v128.27,27.94
  Bottom 0.254: E15.7 181.61,35.56 182.88,36.83 195.58,36.83 196.85,35.56 E10.7 200.03,35.56 201.29,34.29 207.01,34.29 207.65,34.93 219.07,34.93 219.71,35.56 E05.7 | 128.27,28.58 175.26,28.58 v175.9,27.94 | 128.27,28.58 108.58,28.58 106.68,30.48 5.71,30.48 5.71,69.22 E45.5 | 128.27,28.58 v128.27,27.94 | v130.18,144.78 E27.4
CC_SDSQ\  (via drill 0.61)
  Top 0.254: v93.34,55.25 93.34,51.44 E32.1
  Bottom 0.254: v93.34,55.25 91.44,57.15 27.94,57.15 22.86,62.23 6.35,62.23 6.35,66.68 9.53,69.85 17.78,69.85 19.05,71.12 E45.10
CC_SDSS\  (via drill 0.61)
  Top 0.254: v22.23,64.14 22.23,74.3 E45.12 | v89.53,58.42 92.08,55.88 92.08,47.63 E32.3
  Bottom 0.254: v22.23,64.14 28.57,57.79 88.9,57.79 v89.53,58.42
CC_SDST\  (via drill 0.61)
  Top 0.254: v23.5,71.76 25.4,69.85 v25.4,64.14 | v88.27,59.06 88.27,46.36 E32.5
  Bottom 0.254: v23.5,71.76 21.59,73.66 E45.11 | v25.4,64.14 30.48,59.06 v88.27,59.06
CC_SETDLY\  (via drill 0.61)
  Top 0.254: E02.5 245.75,78.11 245.75,104.78 E03.6 241.94,108.59 241.94,150.5 E04.2 | v162.56,100.33 162.56,109.22 E22.4
  Bottom 0.254: v162.56,100.33 163.19,100.97 222.88,100.97 227.33,105.41 241.3,105.41 242.57,106.68 E03.6
CC_T/M_EN  (via drill 0.61)
  Top 0.254: 253.37,140.34 254,139.7 254,83.82 E02.12 | 253.37,140.34 E04.11 | 253.37,140.34 253.37,184.79 244.47,193.68 WTM.2 | 158.12,147.96 158.12,146.69 E23.4 | 158.12,147.96 E23.2 | v21.59,137.8 15.88,132.08 15.88,112.4 E46.5 | v175.9,189.23 158.12,171.45 158.12,147.96
  Bottom 0.254: 233.68,187.33 240.03,193.68 243.21,193.68 WTM.2 | 233.68,187.33 231.78,185.42 R16.1 | E23.4 158.75,144.78 157.48,143.51 119.38,143.51 118.11,142.24 E31.5 115.57,142.24 114.3,140.97 58.42,140.97 57.15,139.7 E43.6 54.61,139.7 52.7,137.8 v21.59,137.8 | 233.68,187.33 230.5,190.5 182.88,190.5 182.25,189.87 176.53,189.87 v175.9,189.23
CC_T/M_EN\  (via drill 0.61)
  Top 0.254: E02.9 256.54,78.74 v256.54,104.14 255.27,105.41 v255.27,125.73 | v114.3,147.32 114.3,142.24 E31.6 118.75,137.8 118.75,130.81 v120.02,129.54
  Bottom 0.254: v256.54,104.14 E03.10 | v114.3,147.32 113.03,148.59 89.53,148.59 87,151.13 58.42,151.13 57.15,149.86 E43.2 | v255.27,125.73 251.46,129.54 v120.02,129.54
CC_TP3\  (via drill 0.61)
  Top 0.254: 241.94,60.96 241.94,81.92 E02.2 | 241.94,60.96 241.94,52.71 E01.1 | v85.09,62.87 85.09,72.39 E37.11 | v167.64,59.06 169.54,57.15 169.54,50.17 E20.13 | v234.31,60.96 241.94,60.96
  Bottom 0.254: v85.09,62.87 87,60.96 165.74,60.96 166.37,60.33 | 166.37,60.33 v167.64,59.06 | v234.31,60.96 233.68,60.33 166.37,60.33
CC_TPG1
  Top 0.254: E14.5 199.39,177.8 203.2,181.61 203.2,185.42 204.47,186.69 207.65,186.69 207.65,184.79 E14.12
CC_TPG1\  (via drill 0.61)
  Top 0.254: v194.94,133.35 196.22,134.62 196.22,173.36 E14.6 | v55.88,130.81 E42.1
  Bottom 0.254: v55.88,130.81 57.15,132.08 118.11,132.08 120.02,133.99 173.35,133.99 173.99,133.35 v194.94,133.35
CC_TPG_CLK  (via drill 0.61)
  Top 0.254: E14.3 v200.66,180.34 | E01.13 249.56,50.17 249.56,64.77 250.19,65.41 250.19,69.85 249.56,70.49 249.56,99.7 253.37,103.51 253.37,135.26 E04.9
  Bottom 0.254: v200.66,180.34 E14.11 | E04.9 E04.5 243.21,145.42 241.94,145.42 241.94,155.58 242.57,156.21 246.38,156.21 246.38,160.66 243.84,163.2 241.3,163.2 222.88,181.61 219.07,181.61 216.53,184.15 200.66,184.15 199.39,182.88 E14.3
CC_TPG_CLK\
  Top 0.254: R25.1 259.08,46.36 257.81,47.63 257.81,137.8 259.08,139.07 C40.1
  Bottom 0.254: C40.1 E04.10
CC_TT_EN
  Bottom 0.254: E19.8 191.77,176.53 222.25,176.53 223.52,175.26 223.52,163.2 222.25,163.2 219.71,160.66 219.71,158.75 228.6,158.75 231.14,156.21 231.14,140.34 229.24,140.34 E08.10
CC_UNIT  (via drill 0.61)
  Top 0.254: 67.31,107.95 70.48,111.13 70.48,136.53 72.39,138.43 76.2,138.43 76.2,143.51 78.74,146.05 80.64,146.05 80.64,145.42 E39.11 | E42.8 67.31,107.95 | 67.31,107.95 v69.85,105.41
  Bottom 0.254: v69.85,105.41 95.25,105.41 96.52,106.68 E34.9
CC_UNIT\  (via drill 0.61)
  Top 0.254: v230.5,54.61 230.5,40.01 E05.11 | v112.39,52.07 106.68,57.79 106.68,99.06 E34.8
  Bottom 0.254: v230.5,54.61 227.97,57.15 150.5,57.15 145.41,52.07 v112.39,52.07
CC_UTS  (via drill 0.61)
  Top 0.254: v87.63,73.66 v87.63,109.22 | v173.35,93.98 170.81,91.44 170.81,81.92 E21.13 | v214.63,93.98 214.63,107.95 215.26,108.59 215.26,186.06 E09.1
  Bottom 0.254: E21.13 166.37,78.74 165.1,77.47 127,77.47 125.73,78.74 E29.13 121.92,78.74 118.11,74.93 115.57,74.93 113.03,72.39 88.9,72.39 v87.63,73.66 | v87.63,109.22 83.82,109.22 82.55,107.95 76.2,107.95 74.93,109.22 E38.5 | v173.35,93.98 v214.63,93.98 231.14,93.98 242.57,105.41 248.92,105.41 250.19,106.68 E03.9
CC_UTS\  (via drill 0.61)
  Top 0.254: v255.27,100.33 255.27,82.55 E02.11
  Bottom 0.254: v255.27,100.33 E03.8
CC_WRT_OK  (via drill 0.61)
  Top 0.254: v149.22,97.16 149.22,117.48 148.59,118.11 140.34,118.11 140.34,117.48 E26.2
  Bottom 0.254: v149.22,97.16 121.92,97.16 120.02,95.25 6.35,95.25 6.35,100.33 E46.6
CON_ALL_HALT  (via drill 0.61)
  Top 0.254: v13.97,140.34 13.97,120.65 E46.1
  Bottom 0.254: v13.97,140.34 24.77,151.13 26.04,151.13 27.3,152.4 J1.RR
DATA00  (via drill 0.61)
  Top 0.254: E05.12 222.88,34.93 222.88,15.88 220.98,13.97 EDGE$.AR1 | v194.31,107.95 194.94,107.32 194.94,46.36 195.58,45.72 v195.58,38.1
  Bottom 0.254: v194.31,107.95 190.5,107.95 189.23,109.22 E17.10 | v195.58,38.1 196.85,36.83 223.52,36.83 227.33,40.64 E05.12
DATA01  (via drill 0.61)
  Top 0.254: 217.81,36.83 222.25,36.83 E05.13 | 217.81,36.83 217.81,13.97 EDGE$.AS1 | v217.17,107.95 217.81,107.32 217.81,67.31 217.17,66.68 217.17,37.47 217.81,36.83
  Bottom 0.254: v217.17,107.95 208.28,107.95 207.01,109.22 E12.10
DATA02  (via drill 0.61)
  Top 0.254: v215.9,38.1 212.09,34.29 212.09,15.88 211.46,15.24 211.46,13.97 EDGE$.AU1 | v217.81,110.49 218.44,109.86 218.44,66.68 217.81,66.04 217.81,46.36 E05.4
  Bottom 0.254: v215.9,38.1 E05.4 | v217.81,110.49 226.06,110.49 227.33,109.22 E07.10
DATA03  (via drill 0.61)
  Top 0.254: EDGE$.AV1 208.28,13.97 208.91,14.61 208.91,36.83 v210.19,38.1 210.19,44.45 214.63,48.9 214.63,84.46 213.36,85.73 213.36,109.86 v210.19,113.03
  Bottom 0.254: v210.19,38.1 212.09,38.1 219.71,45.72 E05.3 | v210.19,113.03 190.5,113.03 189.23,114.3 E17.12
DATA04  (via drill 0.61)
  Top 0.254: E10.12 207.65,42.55 207.65,57.79 207.01,58.42 207.01,67.31 208.28,68.58 208.28,111.76 E12.12 | v153.03,16.51 153.03,15.88 151.13,13.97 EDGE$.BR1 | v188.59,18.42 201.93,31.75 v201.93,40.64
  Bottom 0.254: v153.03,16.51 154.94,18.42 v188.59,18.42 | E10.12 v201.93,40.64
DATA05  (via drill 0.61)
  Top 0.254: EDGE$.BS1 147.96,13.97 147.96,28.58 v149.86,30.48 145.41,34.93 145.41,39.37 148.59,39.37 149.22,40.01 149.22,45.09 153.67,45.09 157.48,48.9 157.48,53.34 156.84,53.98 156.84,99.06 v156.21,99.7 | v230.5,102.24 230.5,112.4 E07.12
  Bottom 0.254: v149.86,30.48 169.54,30.48 169.54,36.83 177.16,44.45 203.2,44.45 204.47,43.18 E10.13 | v230.5,102.24 227.97,99.7 163.19,99.7 162.56,99.06 156.84,99.06 v156.21,99.7
DATA06  (via drill 0.61)
  Top 0.254: v194.31,43.18 193.68,42.55 193.68,29.85 v184.15,20.32 | EDGE$.BU1 141.6,13.97 141.6,20.32 v142.24,20.96 135.89,27.31 v135.89,101.6
  Bottom 0.254: v184.15,20.32 183.51,20.96 v142.24,20.96 | v194.31,43.18 E10.4 | v135.89,101.6 171.45,101.6 179.07,109.22 E17.5
DATA07  (via drill 0.61)
  Top 0.254: 193.04,46.99 v194.31,45.72 | v193.04,109.22 193.04,46.99 | v140.34,15.88 138.43,13.97 EDGE$.BV1 | v182.25,19.69 193.04,30.48 193.04,46.99
  Bottom 0.254: v194.31,45.72 E10.3 | v193.04,109.22 E12.5 | v140.34,15.88 144.15,19.69 v182.25,19.69
DATA08  (via drill 0.61)
  Top 0.254: v216.53,110.49 216.53,108.59 215.26,107.32 215.26,104.14 215.9,103.51 215.9,48.9 214,46.99 214,44.45 v211.46,41.91 211.46,27.31 v210.19,26.04 | v20.95,21.59 20.95,17.15 17.78,13.97 EDGE$.DR1
  Bottom 0.254: v211.46,41.91 190.5,41.91 189.23,40.64 E15.12 | v216.53,110.49 217.81,111.76 E07.4 | v20.95,21.59 27.3,27.94 52.7,27.94 53.34,28.58 62.23,28.58 63.5,27.31 125.73,27.31 127,26.04 v210.19,26.04
DATA09  (via drill 0.61)
  Top 0.254: v184.15,104.14 184.15,64.14 184.78,63.5 184.78,43.82 v184.15,43.18 184.15,33.02 v175.9,24.77 | v19.68,19.05 14.61,13.97 EDGE$.DS1
  Bottom 0.254: v184.15,104.14 E17.7 | v184.15,43.18 E15.13 | v19.68,19.05 27.94,27.31 53.34,27.31 53.98,27.94 61.59,27.94 62.87,26.67 125.09,26.67 127,24.77 v175.9,24.77
DATA10  (via drill 0.61)
  Top 0.254: v177.16,102.24 v177.16,87.63 177.16,39.37 181.61,39.37 182.25,40.01 182.25,41.28 E15.4 | v15.88,87 15.88,21.59 8.26,13.97 EDGE$.DU1
  Bottom 0.254: v177.16,102.24 177.8,102.87 195.58,102.87 196.85,104.14 E12.7 | v15.88,87 17.14,88.27 55.88,88.27 57.78,86.36 97.79,86.36 99.06,87.63 114.3,87.63 115.57,88.9 146.69,88.9 147.96,87.63 v177.16,87.63
DATA11  (via drill 0.61)
  Top 0.254: v215.26,46.99 216.53,48.26 v216.53,104.14 | v9.53,63.5 9.53,18.42 5.08,13.97 EDGE$.DV1 | v183.51,63.5 184.15,62.87 184.15,49.53 E15.3
  Bottom 0.254: v215.26,46.99 182.88,46.99 181.61,45.72 E15.3 | v216.53,104.14 E07.7 | v9.53,63.5 11.43,65.41 36.83,65.41 38.1,64.14 119.38,64.14 120.65,65.41 123.83,65.41 125.73,63.5 v183.51,63.5
DF_COMP_WD  (via drill 0.61)
  Top 0.254: v165.1,114.3 E22.13 | E18.12 186.06,145.42 186.06,141.61 E18.9 | v176.53,118.11 178.44,120.02 178.44,140.34 E18.5
  Bottom 0.254: E22.3 v165.1,114.3 | E18.5 181.61,142.24 184.15,139.7 E18.9 | v176.53,118.11 170.18,118.11 168.91,116.84 E22.13
DF_DB00  (via drill 0.61)
  Top 0.254: 189.87,98.43 189.87,117.48 E17.14 | 189.87,98.43 189.87,83.19 E16.14 | 189.87,98.43 v188.59,98.43
  Bottom 0.254: E34.12 100.33,114.3 99.06,113.03 92.71,113.03 90.17,115.57 61.59,115.57 61.59,108.59 E42.9 64.77,106.68 68.58,102.87 120.65,102.87 123.19,100.33 153.67,100.33 155.57,98.43 v188.59,98.43
DF_DB01  (via drill 0.61)
  Top 0.254: v92.08,121.92 92.08,118.75 E34.2 | v185.42,122.56 185.42,144.78 E18.2 | E11.14 203.2,83.82 203.2,116.84 E12.14
  Bottom 0.254: v92.08,121.92 92.71,122.56 142.88,122.56 143.51,121.92 180.34,121.92 180.97,122.56 v185.42,122.56 190.5,122.56 192.41,120.65 203.2,120.65 204.47,119.38 E12.14
DF_DB02  (via drill 0.61)
  Top 0.254: E06.14 226.06,83.82 v226.06,97.16 226.06,116.84 E07.14 | v120.02,99.7 118.75,100.97 118.75,114.94 E30.2
  Bottom 0.254: E42.13 64.77,116.84 66.04,118.11 114.3,118.11 115.57,116.84 E30.2 | v226.06,97.16 155.57,97.16 153.03,99.7 v120.02,99.7
DF_DB03  (via drill 0.61)
  Top 0.254: v127,85.09 127,111.76 E30.12 | E17.13 186.06,114.94 186.06,85.73 E16.15
  Bottom 0.254: v127,85.09 176.53,85.09 179.07,82.55 185.42,82.55 186.69,83.82 E16.15
DF_HLD\  (via drill 0.61)
  Top 0.254: v59.05,35.56 59.05,45.09 E40.2 | v207.65,29.21 207.65,36.2 E10.11
  Bottom 0.254: v59.05,35.56 60.33,34.29 99.06,34.29 100.33,35.56 E32.8 102.87,35.56 109.22,29.21 v207.65,29.21
DF_SEL_ER  (via drill 0.61)
  Top 0.254: v76.83,48.26 76.83,67.95 E37.6
  Bottom 0.254: v76.83,48.26 78.11,46.99 98.42,46.99 99.69,45.72 E32.12
DF_SEL_ER\  (via drill 0.61)
  Top 0.254: E40.5 50.8,45.72 v50.8,52.07 R11.1
  Bottom 0.254: Q2.3 Q3.3 R11.1 | v50.8,52.07 96.52,52.07 100.33,48.26 E32.13
DF_TIME_ER  (via drill 0.61)
  Top 0.254: v98.42,139.7 99.06,140.34 v99.06,153.67 | v83.82,76.2 85.09,77.47 85.09,116.21 84.45,116.84 84.45,137.8 v86.36,139.7
  Bottom 0.254: E41.2 62.23,74.93 71.12,74.93 72.39,73.66 E37.5 74.93,73.66 76.2,74.93 82.55,74.93 v83.82,76.2 | v99.06,153.67 100.33,154.94 149.86,154.94 153.67,151.13 153.67,149.86 E27.13 | v98.42,139.7 E35.6 v86.36,139.7
DF_TIME_ER\  (via drill 0.61)
  Top 0.254: v77.47,142.24 77.47,138.43 71.12,132.08 71.12,100.97 57.78,87.63 57.78,52.71 E40.1 | v98.42,156.85 95.89,154.31 95.89,146.69 95.25,146.05 92.08,146.05 92.08,144.15 E35.5 | v137.79,156.85 E27.12
  Bottom 0.254: v77.47,142.24 78.74,143.51 91.44,143.51 92.71,142.24 E35.5 | v137.79,156.85 v98.42,156.85
F/R\  (via drill 0.61)
  Top 0.254: v78.74,144.78 78.74,139.7 E39.8
  Bottom 0.254: v78.74,144.78 77.47,146.05 67.31,146.05 64.77,148.59 29.84,148.59 28.57,149.86 J1.TT
GND  (via drill 0.61)
  Top 0.635: E13.12 200.03,150.5 200.03,170.82 E14.7 | E04.8 245.11,135.89 C3.2 | E08.9 E08.8 221.62,136.53 221.62,125.73 222.25,125.1 C7.2 222.25,120.65 E07.1 224.79,115.57 v224.79,90.81 224.79,72.39 E06.8 221.62,67.95 221.62,57.15 222.25,56.52 C5.2 | E08.1 C8.2 C9.2 | E04.1 245.11,156.21 C4.2 244.47,160.02 244.47,189.23 WTM.1 | v214,168.28 214,172.09 E09.7 | v212.72,15.24 212.72,13.97 EDGE$.AT1 | 248.28,66.04 248.28,66.68 E02.7 | 248.28,66.04 248.28,58.42 246.38,56.52 C1.2 246.38,55.25 245.75,54.61 245.75,37.47 E01.7 236.85,28.58 236.85,23.5 | 248.28,66.04 C2.2 | 236.85,23.5 236.85,21.59 C34.- 237.49,20.96 244.47,13.97 EDGE$.AF1 | 236.85,23.5 227.33,13.97 EDGE$.AN1 | E16.8 180.97,67.95 180.97,55.88 C13.2 | E11.8 199.39,67.31 C10.2 200.03,55.88 200.03,34.93 E10.8 | J1.VV J1.UU J1.SS J1.PP J1.MM J1.KK J1.HH J1.EE J1.CC J1.AA J1.Y J1.W J1.U J1.S J1.P J1.M J1.K J1.H J1.E J1.C J1.A J1.B | E12.1 199.39,120.65 C12.2 | E17.1 181.61,120.65 C14.2 181.61,135.89 E18.7 | C28.2 57.15,137.16 E43.7 | v87.63,135.89 C25.2 | C30.2 104.14,153.67 111.76,146.05 111.76,139.07 113.67,137.16 E31.7 | C17.2 172.72,114.94 170.81,116.84 170.81,121.29 165.1,127 165.1,132.08 E23.7 | v111.76,15.24 111.76,13.97 EDGE$.CF1 | EDGE$.CN1 93.34,13.97 v93.34,15.24 93.34,34.93 E32.7 90.17,39.37 90.17,40.64 E36.10 | C21.2 124.46,29.85 122.56,27.94 122.56,13.97 EDGE$.CC1 | EDGE$.BC1 184.15,13.97 184.15,15.24 v177.8,15.24 176.53,13.97 EDGE$.BF1 174.62,13.97 169.54,19.05 169.54,42.55 | 169.54,42.55 169.54,43.82 E20.12 | 169.54,42.55 E20.10 | E20.1 C16.2 E21.8 | E25.8 140.97,67.31 C18.2 141.6,55.88 141.6,49.53 | 141.6,49.53 148.59,49.53 149.22,50.17 149.22,69.85 152.4,73.03 C19.2
  Top 0.635: E29.8 C22.2 E28.1 118.75,48.9 118.75,42.55 E28.5 | 141.6,33.66 143.51,31.75 143.51,13.97 EDGE$.BT1 | 141.6,33.66 E24.7 | 141.6,49.53 141.6,33.66 | E44.1 13.97,52.07 C31.2 13.97,67.31 E45.8 | C44.1 C43.2 30.48,44.45 32.38,42.55 | 32.38,42.55 33.02,41.91 D2.A C42.1 C41.1 33.02,32.39 41.27,24.13 41.27,13.97 EDGE$.DF1 43.18,13.97 v44.45,15.24 50.8,15.24 50.8,13.97 EDGE$.DC1 52.7,13.97 55.24,16.51 55.24,20.32 | 32.38,42.55 24.13,34.29 24.13,13.97 EDGE$.DN1 | v10.79,15.24 10.79,13.97 EDGE$.DT1 | 55.24,20.32 55.24,34.93 E40.7 | 55.24,20.32 73.03,20.32 79.38,13.97 EDGE$.CT1 | E33.7 95.89,70.49 95.89,88.9 C23.2 95.25,102.87 E34.7 | E41.7 53.34,71.12 C26.2 53.98,86.36 56.52,88.9 C27.2 57.15,89.54 56.52,90.17 56.52,103.51 E42.7 C46.- 47.62,105.41 47.62,147.32 40.64,154.31 R37.2 | C24.2 E38.7 | Q4.3 33.02,121.29 36.83,117.48 36.83,109.86 38.1,108.59 R36.2
  Bottom 0.635: C20.2 150.5,165.1 158.12,172.72 E19.7 181.61,172.72 182.88,171.45 189.87,171.45 193.04,174.63 C15.2 193.68,175.26 196.22,172.72 E14.7 199.39,172.72 200.66,173.99 210.82,173.99 212.09,172.72 E09.7 | 232.41,137.16 E04.8 | E08.9 232.41,137.16 | C40.2 258.44,147.32 257.18,148.59 250.19,148.59 E04.1 | 232.41,161.93 242.57,161.93 244.47,160.02 C4.2 | 232.41,161.93 223.52,161.93 221.62,160.02 C8.2 | 232.41,137.16 232.41,161.93 | v214,168.28 214.63,167.64 C9.2 | v212.72,15.24 212.72,13.97 EDGE$.AT1 214.63,13.97 215.9,15.24 224.16,15.24 225.43,13.97 EDGE$.AN1 227.33,13.97 233.04,19.69 234.95,19.69 C34.- 237.49,19.69 238.76,19.69 243.21,15.24 | 243.21,15.24 244.47,13.97 EDGE$.AF2 | 243.21,15.24 252.73,15.24 254,13.97 EDGE$.AC2 | 220.34,92.71 201.29,92.71 200.03,91.44 C11.2 | 220.34,92.71 221.62,91.44 C6.2 | 224.79,92.71 220.34,92.71 | 224.79,92.71 231.14,92.71 242.57,104.14 E03.7 | 195.58,31.75 182.88,31.75 181.61,33.02 E15.8 | 195.58,31.75 196.85,33.02 E10.8 | 195.58,31.75 218.44,31.75 219.71,33.02 E05.8 | 195.58,69.85 182.88,69.85 181.61,68.58 E16.8 179.07,68.58 177.8,67.31 157.48,67.31 | 195.58,69.85 196.85,68.58 E11.8 | 195.58,69.85 218.44,69.85 219.71,68.58 E06.8 | v224.79,90.81 224.79,92.71 | C1.2 245.75,55.88 243.21,53.34 202.56,53.34 200.03,55.88 C10.2 | C12.2 198.75,124.46 197.49,125.73 183.51,125.73 182.25,124.46 C14.2 | E43.7 57.15,137.16 58.42,138.43 71.12,138.43 72.39,137.16 E39.7 74.93,137.16 76.2,135.89 v87.63,135.89 91.44,135.89 | 91.44,135.89 92.71,137.16 E35.7 | 114.3,135.89 115.57,137.16 E31.7 | 91.44,135.89 114.3,135.89 | 137.16,135.89 138.43,137.16 E27.7
  Bottom 0.635: 114.3,135.89 137.16,135.89 | 157.48,135.89 158.75,137.16 E23.7 | 137.16,135.89 157.48,135.89 | 157.48,135.89 168.91,135.89 170.18,137.16 E18.7 | C28.2 46.35,124.46 43.81,121.92 Q5.3 Q4.3 13.34,121.92 8.26,127 C48.1 7.62,128.91 25.4,146.69 J1.UU | EDGE$.CT1 81.28,13.97 82.55,15.24 90.81,15.24 92.08,13.97 EDGE$.CN1 | v111.76,15.24 113.03,13.97 EDGE$.CF2 | v111.76,15.24 110.49,16.51 108.58,16.51 105.41,19.69 C35.- 102.87,19.69 99.69,19.69 93.98,13.97 EDGE$.CN1 | v111.76,15.24 119.38,15.24 120.65,13.97 EDGE$.CC2 | EDGE$.BC2 184.15,13.97 182.88,15.24 v177.8,15.24 176.53,13.97 EDGE$.BF2 174.62,13.97 173.35,15.24 154.31,15.24 | 154.31,15.24 146.05,15.24 144.78,13.97 EDGE$.BT1 | 154.31,15.24 155.57,13.97 EDGE$.BN2 | E20.12 166.37,45.72 161.29,50.8 E20.1 | 120.02,37.47 123.19,40.64 E28.10 133.35,40.64 138.43,35.56 E24.7 | 120.02,37.47 119.38,36.83 | 119.38,36.83 118.11,35.56 E28.7 111.12,35.56 111.12,33.66 111.76,33.02 121.28,33.02 123.83,30.48 C21.2 | 120.02,37.47 E28.5 | 157.48,67.31 158.75,68.58 E21.8 | 157.48,67.31 142.24,67.31 140.97,68.58 E25.8 | 119.38,36.83 100.33,36.83 99.06,35.56 E32.7 | v93.34,15.24 93.34,13.97 EDGE$.CN1 | C47.2 8.26,60.96 13.34,55.88 C31.2 14.61,55.88 15.88,57.15 26.67,57.15 27.94,55.88 C43.2 | EDGE$.DC2 50.8,13.97 49.53,15.24 v44.45,15.24 43.18,13.97 EDGE$.DF2 41.27,13.97 40.01,15.24 20.95,15.24 | v10.79,15.24 10.79,13.97 EDGE$.DT1 11.43,13.97 12.7,15.24 20.95,15.24 | 20.95,15.24 22.23,13.97 EDGE$.DN1 | 114.3,105.41 115.57,104.14 E30.7 | 114.3,105.41 96.52,105.41 95.25,104.14 E34.7 | 114.3,105.41 137.16,105.41 138.43,104.14 E26.7 140.97,104.14 142.24,102.87 157.48,102.87 158.75,104.14 E22.7
  Bottom 0.635: E37.7 C33.2 67.94,68.58 66.67,67.31 | 66.67,67.31 58.42,67.31 57.15,68.58 E41.7 C44.1 | R37.2 41.27,154.94 43.81,157.48 C29.2 | C32.2 7.62,99.7 11.43,103.51 12.06,103.51 E46.7 13.97,104.14 16.51,101.6 34.92,101.6 37.47,104.14 R36.2 38.73,104.14 40.01,102.87 47.62,102.87 C46.- | C24.2 73.03,99.06 70.48,101.6 59.69,101.6 57.15,104.14 E42.7 | 91.44,67.31 92.71,68.58 E33.7 | 91.44,67.31 66.67,67.31 | 91.44,67.31 114.3,67.31 115.57,68.58 E29.8
  pour Bottom (isolate 0.254): 0,19.05 265.43,19.05 265.43,214.63 0,214.63
  pour Top (isolate 0.254): 0,19.05 265.43,19.05 265.43,214.63 0,214.63
INITIALIZE  (via drill 0.61)
  Top 0.254: v88.9,39.37 87.63,38.1 87.63,13.97 EDGE$.CR1
  Bottom 0.254: v88.9,39.37 111.76,39.37 115.57,43.18 E28.4
INTERNAL_IO
  Top 0.254: E33.4 92.08,74.3 92.08,57.79 98.42,51.44 98.42,13.97 EDGE$.CL1
IO_PAUSE
  Top 0.254: E28.9 119.38,33.02 119.38,13.97 EDGE$.CD1
IO_PAUSE\
  Top 0.254: E20.7 161.93,37.47 161.93,41.28 E20.4
  Bottom 0.254: E28.14 125.73,50.8 127,49.53 151.76,49.53 153.03,50.8 157.48,50.8 158.75,49.53 161.29,49.53 163.19,47.63 163.19,43.18 E20.4 158.75,43.18 156.21,40.64 E24.10
MD03  (via drill 0.61)
  Top 0.254: v151.13,23.5 151.13,34.29 E24.9 | v224.16,21.59 224.16,13.97 EDGE$.AP1
  Bottom 0.254: v151.13,23.5 153.03,21.59 v224.16,21.59
MD04  (via drill 0.61)
  Top 0.254: v161.93,44.45 163.83,42.55 163.83,15.24 165.1,13.97 EDGE$.BK1
  Bottom 0.254: v161.93,44.45 158.75,44.45 158.12,45.09 153.67,45.09 151.76,46.99 144.78,46.99 140.97,43.18 E24.4
MD05  (via drill 0.61)
  Top 0.254: v151.13,39.37 152.4,40.64 158.12,40.64 158.12,17.78 161.93,13.97 EDGE$.BL1
  Bottom 0.254: v151.13,39.37 142.24,39.37 140.97,40.64 E24.5
MD06  (via drill 0.61)
  Top 0.254: v155.57,35.56 157.48,33.66 157.48,15.24 158.75,13.97 EDGE$.BM1
  Bottom 0.254: v155.57,35.56 153.03,35.56 151.76,36.83 142.24,36.83 140.97,38.1 E24.6
MD07
  Top 0.254: W2W1.1 154.31,37.47 154.31,13.97 EDGE$.BP1
  Bottom 0.254: E20.5 161.93,38.74 161.93,36.83 156.21,36.83 W2W1.1
MD08  (via drill 0.61)
  Top 0.254: v34.29,29.21 33.66,28.58 33.66,13.97 EDGE$.DK1 | v152.4,27.31 W4W3.1
  Bottom 0.254: E20.6 158.75,38.1 156.84,40.01 154.31,40.01 W4W3.1 | v152.4,27.31 151.76,26.67 127.64,26.67 126.36,27.94 64.14,27.94 62.87,29.21 v34.29,29.21
MD09  (via drill 0.61)
  Top 0.254: v26.67,31.75 28.57,29.85 28.57,13.97 EDGE$.DL1
  Bottom 0.254: v26.67,31.75 17.78,31.75 13.97,35.56 E44.7
MD10  (via drill 0.61)
  Top 0.254: v25.4,33.02 25.4,13.97 EDGE$.DM1
  Bottom 0.254: v25.4,33.02 E44.9
MD11
  Top 0.254: E44.11 22.23,41.28 22.23,15.24 20.95,13.97 EDGE$.DP1
MTR0\  (via drill 0.61)
  Top 0.254: v120.65,64.14 120.65,67.31 E29.7 | v208.28,61.6 209.55,60.33 209.55,40.64 v208.28,39.37
  Bottom 0.254: v120.65,64.14 122.56,62.23 195.58,62.23 196.22,62.87 207.01,62.87 v208.28,61.6 | v208.28,39.37 200.66,39.37 199.39,40.64 E10.5
MTR1\  (via drill 0.61)
  Top 0.254: v114.94,62.87 114.94,74.3 E29.5 | v196.22,61.6 196.22,50.17 E10.2
  Bottom 0.254: v114.94,62.87 116.2,61.6 v196.22,61.6
MTR2\  (via drill 0.61)
  Top 0.254: v120.65,73.66 120.65,74.93 E29.4 | v173.35,39.37 171.45,41.28 171.45,69.85 E21.11
  Bottom 0.254: v120.65,73.66 121.92,72.39 165.1,72.39 166.37,73.66 E21.11 | v173.35,39.37 181.61,39.37 182.88,38.1 E15.11
MTR3\
  Top 0.254: E15.14 186.06,43.82 186.06,40.01 186.69,39.37 186.06,38.74 186.06,34.93 186.69,34.29 189.87,34.29 189.87,32.39 180.34,22.86 170.81,22.86 170.81,65.41 E21.9
MTR4\  (via drill 0.61)
  Top 0.254: v178.44,69.85 178.44,42.55 E15.5
  Bottom 0.254: v178.44,69.85 162.56,69.85 161.29,71.12 E21.7
MTR5\  (via drill 0.61)
  Top 0.254: v163.83,52.07 161.93,53.98 161.93,74.3 E21.5
  Bottom 0.254: v163.83,52.07 175.26,52.07 179.07,48.26 E15.2
N$1  (via drill 0.61)
  Top 0.254: v212.09,85.09 212.09,75.57 213.36,74.3 R3.1
  Bottom 0.254: 195.58,87.63 182.88,87.63 181.61,86.36 E16.1 | 195.58,87.63 196.85,86.36 E11.1 | 212.09,87.63 195.58,87.63 | 212.09,87.63 218.44,87.63 219.71,86.36 E06.1 | E16.10 189.23,71.12 189.87,71.76 196.22,71.76 196.85,72.39 203.2,72.39 204.47,71.12 E11.10 207.01,71.12 209.55,73.66 R3.1 214,73.66 215.26,72.39 226.06,72.39 227.33,71.12 E06.10 | v212.09,85.09 212.09,87.63
N$2  (via drill 0.61)
  Top 0.254: v120.02,132.72 120.02,135.26 E31.9 | v233.04,133.35 241.3,125.1 241.3,88.9 E02.1
  Bottom 0.254: v120.02,132.72 120.65,132.08 231.78,132.08 v233.04,133.35
N$3
  Top 0.254: E16.2 182.25,85.73 182.25,112.4 E17.3
N$4
  Top 0.254: E16.3 178.44,83.19 178.44,114.94 E17.2
N$5  (via drill 0.61)
  Top 0.254: E21.14 167,81.92 167,83.19 E21.15 | v163.83,71.12 162.56,72.39 162.56,76.2 161.29,77.47 158.12,77.47 158.12,79.38 E21.3 159.38,81.92 159.38,83.19 E21.2 159.38,84.46 159.38,85.73 E21.1 | E29.3 116.2,81.92 116.2,83.19 E29.2 116.2,84.46 116.2,85.73 E29.1 | E29.10 126.36,73.03 126.36,79.38 E29.14 123.83,81.92 123.83,83.19 E29.15
  Bottom 0.254: v163.83,71.12 E21.10 | E21.14 E21.3 158.75,81.28 157.48,82.55 133.99,82.55 132.72,81.28 R2.1 E29.14 E29.3
N$6
  Top 0.254: E43.9 61.59,141.61 61.59,147.96 E43.13 65.41,151.77 65.41,153.04 64.77,153.67 R14.2
N$7  (via drill 0.61)
  Top 0.254: v155.57,76.2 155.57,83.82 147.96,91.44 147.96,103.51 E26.8
  Bottom 0.254: E06.6 219.71,73.66 218.44,74.93 200.66,74.93 199.39,73.66 E11.6 196.85,73.66 195.58,72.39 182.88,72.39 181.61,73.66 E16.6 176.53,73.66 175.26,74.93 156.84,74.93 v155.57,76.2
N$8
  Top 0.254: E11.2 200.66,86.36 200.66,111.76 E12.3
N$9
  Top 0.254: E11.3 196.22,83.19 196.22,114.94 E12.2
N$11
  Top 0.254: E11.15 207.65,85.73 207.65,99.7 203.84,103.51 203.84,114.94 E12.13
N$13
  Top 0.254: E06.2 223.52,86.36 223.52,111.76 E07.3
N$14
  Top 0.254: E06.3 219.07,83.19 219.07,114.94 E07.2
N$16
  Top 0.254: E06.15 230.5,85.73 230.5,99.7 226.69,103.51 226.69,114.94 E07.13
N$17
  Top 0.254: E14.13 203.84,183.52 203.84,179.71 E14.10 | 219.07,179.71 219.07,183.52 E09.13 | E09.10 219.07,179.71 | 219.07,179.71 219.07,151.77 E08.3 | E14.1 196.22,186.06 196.22,182.25 E14.4
  Bottom 0.254: R22.2 177.8,187.96 179.07,189.23 195.58,189.23 196.85,187.96 E14.1 | E08.3 222.25,149.86 223.52,148.59 229.87,148.59 230.5,147.96 230.5,142.88 229.24,142.88 E08.11 | E14.4 199.39,180.34 201.93,177.8 E14.10 207.01,177.8 209.55,180.34 E09.4 217.17,180.34 219.71,177.8 E09.10
N$18  (via drill 0.61)
  Top 0.254: v107.95,74.93 107.31,75.57 107.31,111.13 115.57,119.38 E30.1
  Bottom 0.254: v107.95,74.93 83.82,74.93 82.55,73.66 E37.10
N$20  (via drill 0.61)
  Top 0.254: E43.10 62.87,142.88 62.87,144.15 E43.11 66.04,147.32 66.04,163.2 65.41,163.83 65.41,173.99 68.58,177.17 R13.2 | v135.89,116.84 134.62,118.11 v134.62,160.02
  Bottom 0.254: v135.89,116.84 138.43,114.3 E26.3 | v134.62,160.02 118.11,176.53 70.48,176.53 69.22,177.8 R13.2
N$22  (via drill 0.61)
  Top 0.254: E37.2 75.56,83.19 75.56,117.48 E38.1 74.3,120.02 74.3,133.99 v78.74,138.43
  Bottom 0.254: v78.74,138.43 137.16,138.43 138.43,139.7 E27.6
N$25  (via drill 0.61)
  Top 0.254: v66.04,46.99 65.41,47.63 65.41,66.68 E41.8
  Bottom 0.254: v66.04,46.99 74.93,46.99 75.56,46.36 79.38,46.36 80.01,45.72 E36.12
N$29
  Bottom 0.254: E26.9 148.59,106.68 149.86,105.41 165.1,105.41 166.37,104.14 E22.8
N$30  (via drill 0.61)
  Top 0.254: v121.28,109.86 121.28,133.99 E31.8
  Bottom 0.254: v121.28,109.86 123.19,107.95 163.83,107.95 166.37,105.41 168.91,105.41 169.54,106.05 169.54,108.59 168.28,108.59 E22.10
N$31
  Top 0.254: E22.6 157.48,104.14 157.48,76.2 E21.6
  Bottom 0.254: E29.6 118.11,73.66 119.38,74.93 155.57,74.93 156.84,73.66 E21.6
N$32
  Bottom 0.254: E18.13 189.23,149.86 194.31,154.94 E13.1
N$33  (via drill 0.61)
  Top 0.254: v185.42,147.32 182.25,150.5 v182.25,154.94 | E39.1 74.3,153.04 74.3,154.94 v74.93,155.58 R8.1
  Bottom 0.254: v182.25,154.94 181.61,155.58 v74.93,155.58 | v185.42,147.32 E18.11
N$34
  Bottom 0.254: E18.8 E13.8
N$35
  Bottom 0.254: E31.12 125.73,147.32 127,148.59 195.58,148.59 196.85,147.32 E13.4 E13.13
N$36  (via drill 0.61)
  Top 0.254: v76.83,133.35 76.83,81.92 E37.3
  Bottom 0.254: v76.83,133.35 78.11,134.62 172.72,134.62 173.99,135.89 181.61,135.89 | 181.61,135.89 182.25,136.53 182.25,139.07 180.97,139.07 E18.6 | 181.61,135.89 199.39,135.89 E13.11
N$37  (via drill 0.61)
  Top 0.254: v162.56,113.03 162.56,116.84 E22.1
  Bottom 0.254: v162.56,113.03 163.83,111.76 E22.11
N$38  (via drill 0.61)
  Top 0.254: v77.47,149.86 78.74,151.13 78.74,159.39 | R9.1 78.74,159.39 | v191.13,153.04 v191.13,142.24 | 78.74,159.39 v78.11,159.39
  Bottom 0.254: v77.47,149.86 74.93,147.32 E39.3 | v191.13,153.04 186.06,158.12 85.09,158.12 83.82,159.39 v78.11,159.39 | v191.13,142.24 E18.10
N$39  (via drill 0.61)
  Top 0.254: 100.33,185.42 92.71,185.42 87.63,180.34 87.63,178.44 83.82,174.63 83.82,152.4 E39.13 | 100.33,185.42 R10.1 | v114.3,149.86 105.41,158.75 105.41,188.6 104.78,189.23 101.6,189.23 101.6,186.69 100.33,185.42
  Bottom 0.254: v114.3,149.86 115.57,148.59 118.11,148.59 120.65,146.05 177.8,146.05 179.07,144.78 E18.4
N$40  (via drill 0.61)
  Top 0.254: v78.11,77.47 78.11,43.18 E36.11
  Bottom 0.254: v78.11,77.47 66.04,77.47 64.77,78.74 E41.12
N$41  (via drill 0.61)
  Top 0.254: v119.38,77.47 121.92,74.93 121.92,57.79 123.19,56.52 v123.19,53.34 | v208.28,58.42 208.28,40.64 207.01,39.37 203.84,39.37 203.84,43.82 E10.14
  Bottom 0.254: v119.38,77.47 80.01,77.47 78.74,76.2 E37.4 | v123.19,53.34 145.41,53.34 149.86,57.79 207.65,57.79 v208.28,58.42
N$42
  Top 0.254: E36.3 73.03,46.36 73.03,47.63 E36.2 71.75,50.17 71.75,104.78 E38.6
N$43
  Top 0.254: E38.4 73.03,112.4 73.03,113.67 E38.3
N$44  (via drill 0.61)
  Top 0.254: v60.33,39.37 59.69,40.01 v59.69,74.93
  Bottom 0.254: v60.33,39.37 82.55,39.37 83.82,38.1 E32.6 | v59.69,74.93 E41.3
N$45  (via drill 0.61)
  Top 0.254: v58.42,50.8 58.42,82.55 64.77,82.55 65.41,81.92 65.41,78.11 E41.11
  Bottom 0.254: v58.42,50.8 59.69,49.53 91.44,49.53 92.71,48.26 E32.2
N$46  (via drill 0.61)
  Top 0.254: v70.48,71.12 71.12,70.49 71.12,43.18 72.39,41.91 91.44,41.91 91.44,40.64 92.71,39.37 95.89,39.37 95.89,41.28 E32.4
  Bottom 0.254: v70.48,71.12 E41.9
N$47  (via drill 0.61)
  Top 0.254: v74.3,96.52 74.3,84.46 E37.1 | v121.28,100.97 122.56,102.24 122.56,132.72 126.36,136.53 126.36,142.88 E31.11
  Bottom 0.254: v74.3,96.52 110.49,96.52 114.94,100.97 v121.28,100.97
N$48  (via drill 0.61)
  Top 0.254: E35.11 99.69,146.69 99.69,147.96 E35.13 | v120.02,145.42 123.19,142.24 E31.10
  Bottom 0.254: v120.02,145.42 119.38,146.05 104.14,146.05 102.87,144.78 E35.11
N$49
  Bottom 0.254: E35.3 E35.12
N$50
  Top 0.254: E35.4 97.16,141.61 97.16,139.7 99.69,137.16 E35.8
N$51
  Top 0.254: D1.C R48.2 43.18,57.15 46.35,57.15 46.99,56.52 46.99,37.47 45.72,36.2 Q1.2
N$52
  Top 0.254: Q1.1 45.72,33.66 44.45,34.93 44.45,48.26 45.72,49.53 D5.C R41.2
N$53
  Top 0.254: Q1.3 43.18,36.2 41.91,37.47 41.91,46.99 39.37,49.53 39.37,64.14 38.1,65.41 R27.1
  Bottom 0.254: E32.9 100.33,38.1 99.06,36.83 45.09,36.83 43.81,35.56 Q1.3
N$54
  Top 0.254: D3.A 35.56,41.91 33.02,44.45 D2.C
N$55
  Top 0.254: D10.C R40.2